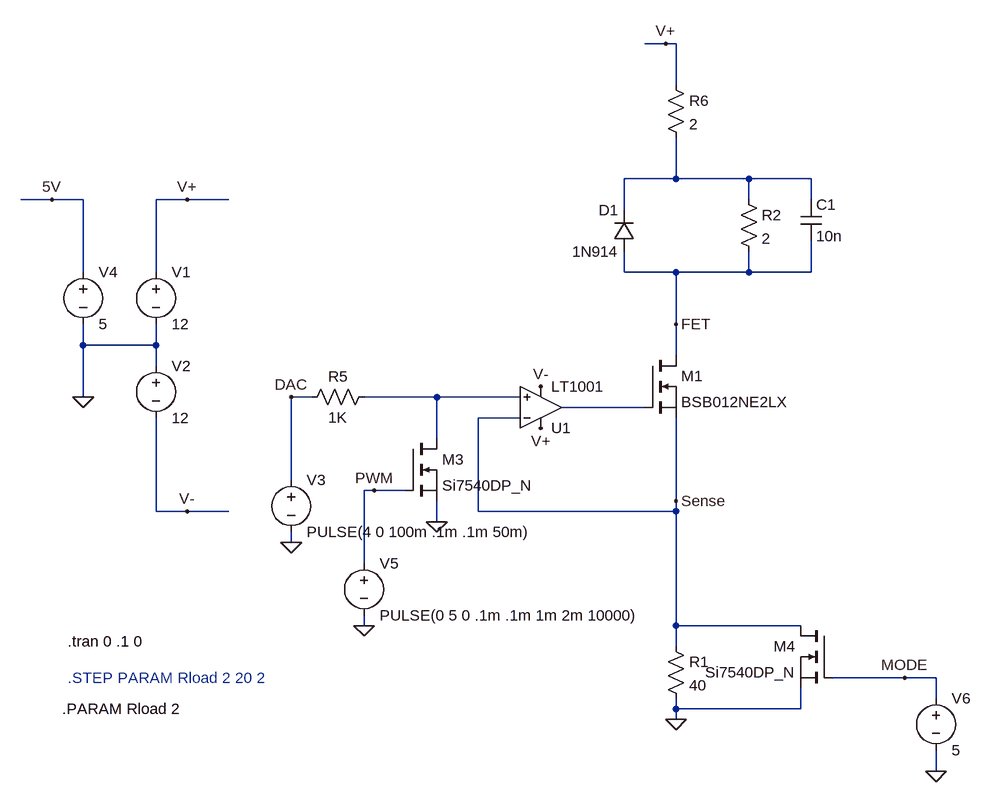
[diagram p0: schematic CurrentSource.asc]
CurrentSource.asc, the LTspice schematic file:
Version 4
SHEET 1 1772 772
WIRE 368 -368 336 -368
WIRE 384 -368 368 -368
WIRE 384 -304 384 -368
WIRE 384 -160 384 -224
WIRE 384 -160 304 -160
WIRE 496 -160 384 -160
WIRE 592 -160 496 -160
WIRE -576 -128 -624 -128
WIRE -528 -128 -576 -128
WIRE -368 -128 -416 -128
WIRE -304 -128 -368 -128
WIRE 496 -128 496 -160
WIRE 592 -128 592 -160
WIRE 304 -112 304 -160
WIRE -528 -16 -528 -128
WIRE -416 -16 -416 -128
WIRE 304 -16 304 -48
WIRE 384 -16 304 -16
WIRE 496 -16 496 -48
WIRE 496 -16 384 -16
WIRE 592 -16 592 -64
WIRE 592 -16 496 -16
WIRE 384 64 384 -16
WIRE -528 96 -528 64
WIRE -416 96 -416 64
WIRE -416 96 -528 96
WIRE 384 112 384 64
WIRE -416 128 -416 96
WIRE -528 176 -528 96
WIRE -176 176 -208 176
WIRE 16 176 -96 176
WIRE 144 176 16 176
WIRE 336 192 208 192
WIRE 144 208 80 208
WIRE 16 240 16 176
WIRE -208 304 -208 176
WIRE -80 320 -96 320
WIRE -32 320 -80 320
WIRE 384 336 384 208
WIRE -416 352 -416 208
WIRE -368 352 -416 352
WIRE -304 352 -368 352
WIRE 80 352 80 208
WIRE 384 352 384 336
WIRE 384 352 80 352
WIRE 16 368 16 336
WIRE -208 400 -208 384
WIRE -96 432 -96 320
WIRE -96 528 -96 512
WIRE 384 528 384 352
WIRE 576 528 384 528
WIRE 384 560 384 528
WIRE 736 608 624 608
WIRE 784 608 736 608
WIRE 784 640 784 608
WIRE 384 656 384 640
WIRE 576 656 576 624
WIRE 576 656 384 656
WIRE 384 672 384 656
WIRE 784 752 784 720
FLAG -528 176 0
FLAG -368 -128 V+
FLAG -368 352 V-
FLAG 176 160 V-
FLAG 176 224 V+
FLAG 384 672 0
FLAG -208 400 0
FLAG 384 64 FET
FLAG 384 336 Sense
FLAG -576 -128 5V
FLAG 368 -368 V+
FLAG -96 528 0
FLAG 16 368 0
FLAG 784 752 0
FLAG 736 608 MODE
FLAG -208 176 DAC
FLAG -80 320 PWM
SYMBOL Opamps\\LT1001 176 256 M180
SYMATTR InstName U1
SYMBOL voltage -416 -32 R0
WINDOW 123 0 0 Left 2
WINDOW 39 0 0 Left 2
SYMATTR InstName V1
SYMATTR Value 12
SYMBOL voltage -416 112 R0
WINDOW 123 0 0 Left 2
WINDOW 39 0 0 Left 2
SYMATTR InstName V2
SYMATTR Value 12
SYMBOL res 368 544 R0
SYMATTR InstName R1
SYMATTR Value 40
SYMBOL nmos 336 112 R0
SYMATTR InstName M1
SYMATTR Value BSB012NE2LX
SYMBOL voltage -208 288 R0
WINDOW 123 0 0 Left 2
WINDOW 39 0 0 Left 2
SYMATTR InstName V3
SYMATTR Value PULSE(4 0 100m .1m .1m 50m)
SYMBOL res 480 -144 R0
SYMATTR InstName R2
SYMATTR Value 2
SYMBOL voltage -528 -32 R0
WINDOW 123 0 0 Left 2
WINDOW 39 0 0 Left 2
SYMATTR InstName V4
SYMATTR Value 5
SYMBOL diode 320 -48 R180
WINDOW 0 24 64 Left 2
WINDOW 3 24 0 Left 2
SYMATTR InstName D1
SYMATTR Value 1N914
SYMBOL cap 576 -128 R0
SYMATTR InstName C1
SYMATTR Value 10n
SYMBOL res -80 160 R90
WINDOW 0 0 56 VBottom 2
WINDOW 3 32 56 VTop 2
SYMATTR InstName R5
SYMATTR Value 1K
SYMBOL voltage -96 416 R0
WINDOW 123 0 0 Left 2
WINDOW 39 0 0 Left 2
SYMATTR InstName V5
SYMATTR Value PULSE(0 5 0 .1m .1m 1m 2m 10000)
SYMBOL nmos -32 240 R0
SYMATTR InstName M3
SYMATTR Value Si7540DP_N
SYMBOL res 368 -320 R0
SYMATTR InstName R6
SYMATTR Value 2
SYMBOL nmos 624 528 M0
SYMATTR InstName M4
SYMATTR Value Si7540DP_N
SYMBOL voltage 784 624 R0
WINDOW 123 0 0 Left 2
WINDOW 39 0 0 Left 2
SYMATTR InstName V6
SYMATTR Value 5
TEXT -552 552 Left 2 !.tran 0 .1 0
TEXT -552 608 Left 2 ;.STEP PARAM Rload 2 20 2
TEXT -560 656 Left 2 !.PARAM Rload 2

The netlist it stands for:
* CurrentSource.asc
XU1 N002 Sense V+ V- N003 LT1001  ; pins In+ In- V+ V- OUT
V1 V+ 0 12
V2 0 V- 12
R1 Sense 0 40
M1 FET N003 Sense Sense BSB012NE2LX
V3 DAC 0 PULSE(4 0 100m .1m .1m 50m)
R2 N001 FET 2
V4 5V 0 5
D1 FET N001 1N914
C1 N001 FET 10n
R5 N002 DAC 1K
V5 PWM 0 PULSE(0 5 0 .1m .1m 1m 2m 10000)
M3 N002 PWM 0 0 Si7540DP_N
R6 V+ N001 2
M4 Sense MODE 0 0 Si7540DP_N
V6 MODE 0 5
.model D D
.lib standard.dio
.model NMOS NMOS
.model PMOS PMOS
.lib standard.mos
.tran 0 .1 0
* .STEP PARAM Rload 2 20 2
.PARAM Rload 2
.lib LTC.lib
.backanno
.end